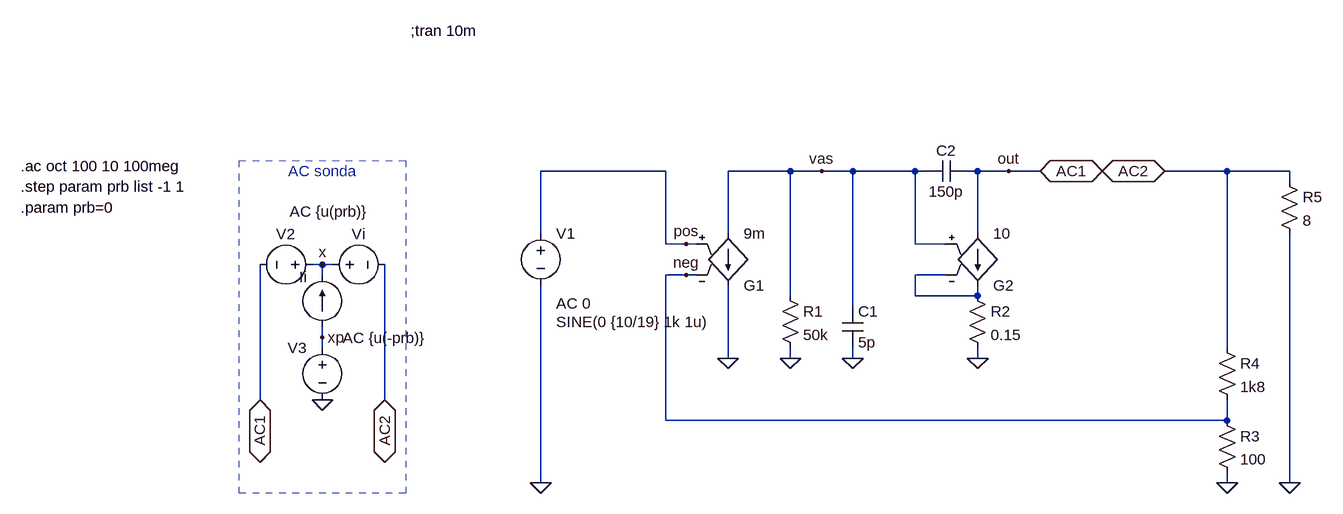
[diagram p0: schematic micro_model.asc]
micro_model.asc, the LTspice schematic file:
Version 4
SHEET 1 1272 680
WIRE 64 32 -128 32
WIRE 256 32 160 32
WIRE 304 32 256 32
WIRE 352 32 304 32
WIRE 448 32 352 32
WIRE 464 32 448 32
WIRE 544 32 528 32
WIRE 592 32 544 32
WIRE 640 32 592 32
WIRE 928 32 832 32
WIRE 1024 32 928 32
WIRE 1024 48 1024 32
WIRE -128 128 -128 32
WIRE 160 128 160 32
WIRE 544 128 544 32
WIRE 64 144 64 32
WIRE 96 144 64 144
WIRE 112 144 96 144
WIRE 448 144 448 32
WIRE 496 144 448 144
WIRE -464 176 -480 176
WIRE -448 176 -464 176
WIRE -464 192 -464 176
WIRE 96 192 64 192
WIRE 112 192 96 192
WIRE 496 192 448 192
WIRE 256 224 256 32
WIRE 448 224 448 192
WIRE 544 224 544 208
WIRE 544 224 448 224
WIRE 352 240 352 32
WIRE -464 288 -464 272
WIRE -464 304 -464 288
WIRE 928 304 928 32
WIRE 160 320 160 208
WIRE 256 320 256 304
WIRE 352 320 352 304
WIRE 544 320 544 304
WIRE -560 384 -560 176
WIRE -368 384 -368 176
WIRE 64 416 64 192
WIRE 928 416 928 384
WIRE 928 416 64 416
WIRE -128 512 -128 208
WIRE 928 512 928 496
WIRE 1024 512 1024 128
FLAG 160 320 0
FLAG -128 512 0
FLAG 592 32 out
FLAG 928 512 0
FLAG 544 320 0
FLAG 256 320 0
FLAG 352 320 0
FLAG 304 32 vas
FLAG 96 144 pos
FLAG 96 192 neg
FLAG 640 32 AC1
IOPIN 640 32 BiDir
FLAG 832 32 AC2
IOPIN 832 32 BiDir
FLAG 1024 512 0
FLAG -464 176 x
FLAG -464 288 xp
FLAG -560 384 AC1
IOPIN -560 384 BiDir
FLAG -368 384 AC2
IOPIN -368 384 BiDir
FLAG -464 384 0
SYMBOL voltage -128 112 R0
WINDOW 3 24 152 Left 2
WINDOW 123 24 124 Left 2
WINDOW 39 0 0 Left 2
SYMATTR Value SINE(0 {10/19} 1k 1u)
SYMATTR Value2 AC 0
SYMATTR InstName V1
SYMBOL res 912 400 R0
SYMATTR InstName R3
SYMATTR Value 100
SYMBOL res 912 288 R0
SYMATTR InstName R4
SYMATTR Value 1k8
SYMBOL res 240 208 R0
SYMATTR InstName R1
SYMATTR Value 50k
SYMBOL res 528 208 R0
SYMATTR InstName R2
SYMATTR Value 0.15
SYMBOL cap 336 240 R0
SYMATTR InstName C1
SYMATTR Value 5p
SYMBOL g2 544 224 M180
SYMATTR InstName G2
SYMATTR Value 10
SYMBOL g2 160 224 M180
SYMATTR InstName G1
SYMATTR Value 9m
SYMBOL cap 528 16 R90
WINDOW 0 0 32 VBottom 2
WINDOW 3 32 32 VTop 2
SYMATTR InstName C2
SYMATTR Value 150p
SYMBOL res 1008 32 R0
SYMATTR InstName R5
SYMATTR Value 8
SYMBOL current -464 272 R180
WINDOW 0 24 77 Left 2
WINDOW 3 24 0 Invisible 2
WINDOW 123 -71 178 Left 2
WINDOW 39 0 0 Left 2
SYMATTR InstName Ii
SYMATTR Value 0
SYMATTR Value2 AC {u(prb)}
SYMBOL voltage -464 176 R270
WINDOW 0 32 56 VTop 2
WINDOW 3 -32 56 Invisible 2
WINDOW 123 -97 96 VBottom 2
WINDOW 39 -32 56 VBottom 2
SYMATTR InstName Vi
SYMATTR Value 0
SYMATTR Value2 AC {u(-prb)}
SYMBOL voltage -464 176 R90
WINDOW 0 -32 56 VBottom 2
WINDOW 3 32 56 Invisible 2
WINDOW 123 0 0 Left 2
WINDOW 39 0 0 Left 2
SYMATTR InstName V2
SYMATTR Value 0
SYMBOL voltage -464 288 M0
WINDOW 123 0 0 Left 2
WINDOW 39 0 0 Left 2
WINDOW 3 24 96 Invisible 2
SYMATTR Value 0
SYMATTR InstName V3
TEXT -464 32 Center 2 ;AC sonda
TEXT -928 88 Left 2 !.param prb=0
TEXT -928 56 Left 2 !.step param prb list -1 1
TEXT -928 24 Left 2 !.ac oct 100 10 100meg
TEXT -328 -184 Left 2 !;tran 10m
RECTANGLE Normal -336 528 -592 16 2

The netlist it stands for:
* micro_model.asc
V1 pos 0 SINE(0 {10/19} 1k 1u) AC 0
R3 neg 0 100
R4 AC2 neg 1k8
R1 vas 0 50k
R2 N001 0 0.15
C1 vas 0 5p
G2 AC1 N001 vas N001 10
G1 vas 0 pos neg 9m
C2 AC1 vas 150p
R5 AC2 0 8
Ii xp x 0 AC {u(prb)}
Vi x AC2 0 AC {u(-prb)}
V2 x AC1 0
V3 xp 0 0
* AC sonda
.param prb=0
.step param prb list -1 1
.ac oct 100 10 100meg
;tran 10m
.backanno
.end